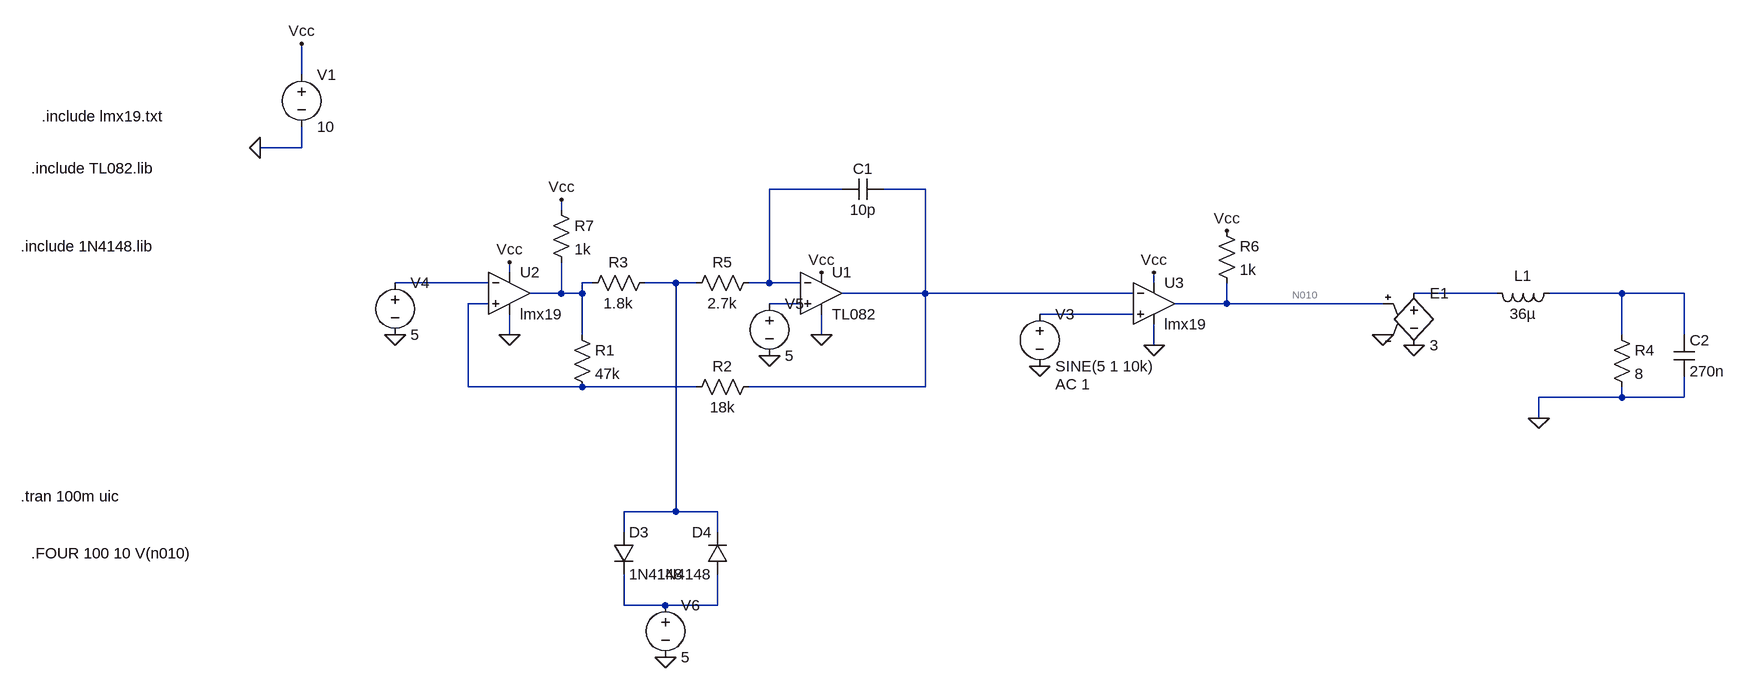
[diagram p0: schematic entrada-500k.asc]
entrada-500k.asc, the LTspice schematic file:
Version 4
SHEET 1 3644 1844
WIRE -336 -16 -336 -64
WIRE -336 96 -336 64
WIRE -336 96 -400 96
WIRE 496 160 384 160
WIRE 624 160 560 160
WIRE 64 192 64 176
WIRE -16 288 -16 272
WIRE -48 304 -192 304
WIRE 112 304 96 304
WIRE 240 304 192 304
WIRE 272 304 240 304
WIRE 384 304 384 160
WIRE 384 304 352 304
WIRE 432 304 384 304
WIRE 976 304 976 288
WIRE 64 320 64 272
WIRE 64 320 16 320
WIRE 96 320 96 304
WIRE 96 320 64 320
WIRE 624 320 624 160
WIRE 624 320 496 320
WIRE 944 320 624 320
WIRE 1504 320 1376 320
WIRE 1696 320 1584 320
WIRE 1792 320 1696 320
WIRE -48 336 -80 336
WIRE 432 336 384 336
WIRE 1088 336 1088 304
WIRE 1088 336 1008 336
WIRE 1328 336 1088 336
WIRE 944 352 800 352
WIRE -16 384 -16 352
WIRE 96 384 96 320
WIRE 464 384 464 352
WIRE 1696 384 1696 320
WIRE 1792 384 1792 320
WIRE 976 400 976 368
WIRE -80 464 -80 336
WIRE 96 464 -80 464
WIRE 272 464 96 464
WIRE 624 464 624 320
WIRE 624 464 352 464
WIRE 1696 480 1696 464
WIRE 1696 480 1568 480
WIRE 1792 480 1792 448
WIRE 1792 480 1696 480
WIRE 1568 512 1568 480
WIRE 240 656 240 304
WIRE 240 656 160 656
WIRE 304 656 240 656
WIRE 160 688 160 656
WIRE 304 688 304 656
WIRE 160 800 160 752
WIRE 224 800 160 800
WIRE 304 800 304 752
WIRE 304 800 224 800
FLAG -400 96 0
FLAG -336 -64 Vcc
FLAG 976 288 Vcc
FLAG 800 432 0
FLAG 1088 224 Vcc
FLAG 1568 512 0
FLAG 1328 384 0
FLAG 1376 400 0
FLAG -16 272 Vcc
FLAG 464 288 Vcc
FLAG -192 384 0
FLAG 384 416 0
FLAG -16 384 0
FLAG 464 384 0
FLAG 64 176 Vcc
FLAG 224 880 0
FLAG 976 400 0
SYMBOL voltage -336 -32 R0
SYMATTR InstName V1
SYMATTR Value 10
SYMBOL Opamps\\opamp2 976 272 R0
SYMATTR InstName U3
SYMATTR Value lmx19
SYMBOL voltage 800 336 R0
WINDOW 123 24 124 Left 2
WINDOW 39 0 0 Left 2
SYMATTR Value2 AC 1
SYMATTR InstName V3
SYMATTR Value SINE(5 1 10k)
SYMBOL res 1072 208 R0
SYMATTR InstName R6
SYMATTR Value 1k
SYMBOL ind 1600 304 R90
WINDOW 0 5 56 VBottom 2
WINDOW 3 32 56 VTop 2
SYMATTR InstName L1
SYMATTR Value 36µ
SYMBOL res 1680 368 R0
SYMATTR InstName R4
SYMATTR Value 8
SYMBOL cap 1776 384 R0
SYMATTR InstName C2
SYMATTR Value 270n
SYMBOL e 1376 304 R0
SYMATTR InstName E1
SYMATTR Value 3
SYMBOL cap 560 144 R90
WINDOW 0 0 32 VBottom 2
WINDOW 3 32 32 VTop 2
SYMATTR InstName C1
SYMATTR Value 10p
SYMBOL res 80 368 R0
SYMATTR InstName R1
SYMATTR Value 47k
SYMBOL res 368 448 R90
WINDOW 0 0 56 VBottom 2
WINDOW 3 32 56 VTop 2
SYMATTR InstName R2
SYMATTR Value 18k
SYMBOL res 208 288 R90
WINDOW 0 0 56 VBottom 2
WINDOW 3 32 56 VTop 2
SYMATTR InstName R3
SYMATTR Value 1.8k
SYMBOL voltage -192 288 R0
SYMATTR InstName V4
SYMATTR Value 5
SYMBOL voltage 384 320 R0
SYMATTR InstName V5
SYMATTR Value 5
SYMBOL TL082 464 256 R0
SYMATTR InstName U1
SYMBOL res 368 288 R90
WINDOW 0 0 56 VBottom 2
WINDOW 3 32 56 VTop 2
SYMATTR InstName R5
SYMATTR Value 2.7k
SYMBOL res 48 176 R0
SYMATTR InstName R7
SYMATTR Value 1k
SYMBOL diode 144 688 R0
SYMATTR InstName D3
SYMATTR Value 1N4148
SYMBOL diode 320 752 R180
WINDOW 0 24 64 Left 2
WINDOW 3 24 0 Left 2
SYMATTR InstName D4
SYMATTR Value 1N4148
SYMBOL voltage 224 784 R0
SYMATTR InstName V6
SYMATTR Value 5
SYMBOL Opamps\\opamp2 -16 256 R0
SYMATTR InstName U2
SYMATTR Value lmx19
TEXT -752 128 Left 2 !.include TL082.lib
TEXT -768 248 Left 2 !.include 1N4148.lib
TEXT -736 48 Left 2 !.include lmx19.txt
TEXT -768 632 Left 2 !.tran 100m uic
TEXT -752 720 Left 2 !.FOUR 100 10 V(n010)

The netlist it stands for:
* entrada-500k.asc
V1 Vcc 0 10
XU3 N011 N002 Vcc 0 N010 lmx19  ; pins In+ In- V+ V- OUT
V3 N011 0 SINE(5 1 10k) AC 1
R6 Vcc N010 1k
L1 N007 N006 36µ
R4 N007 0 8
C2 N007 0 270n
E1 N006 0 N010 0 3
C1 N002 N001 10p
R1 N004 N008 47k
R2 N002 N008 18k
R3 N005 N004 1.8k
V4 N003 0 5
V5 N009 0 5
* U1: TL082 (symbol TL082 not available, pins judged from their places): In+=N009 In-=N001 V+=Vcc V-=0 OUT=N002
R5 N001 N005 2.7k
R7 Vcc N004 1k
D3 N005 N012 1N4148
D4 N012 N005 1N4148
V6 N012 0 5
XU2 N008 N003 Vcc 0 N004 lmx19  ; pins In+ In- V+ V- OUT
.model D D
.lib standard.dio
.include TL082.lib
.include 1N4148.lib
.include lmx19.txt
.tran 100m uic
.FOUR 100 10 V(n010)
.backanno
.end